# Altium schematic sheet Функциональная.SchDoc
size 389 x 214 mm
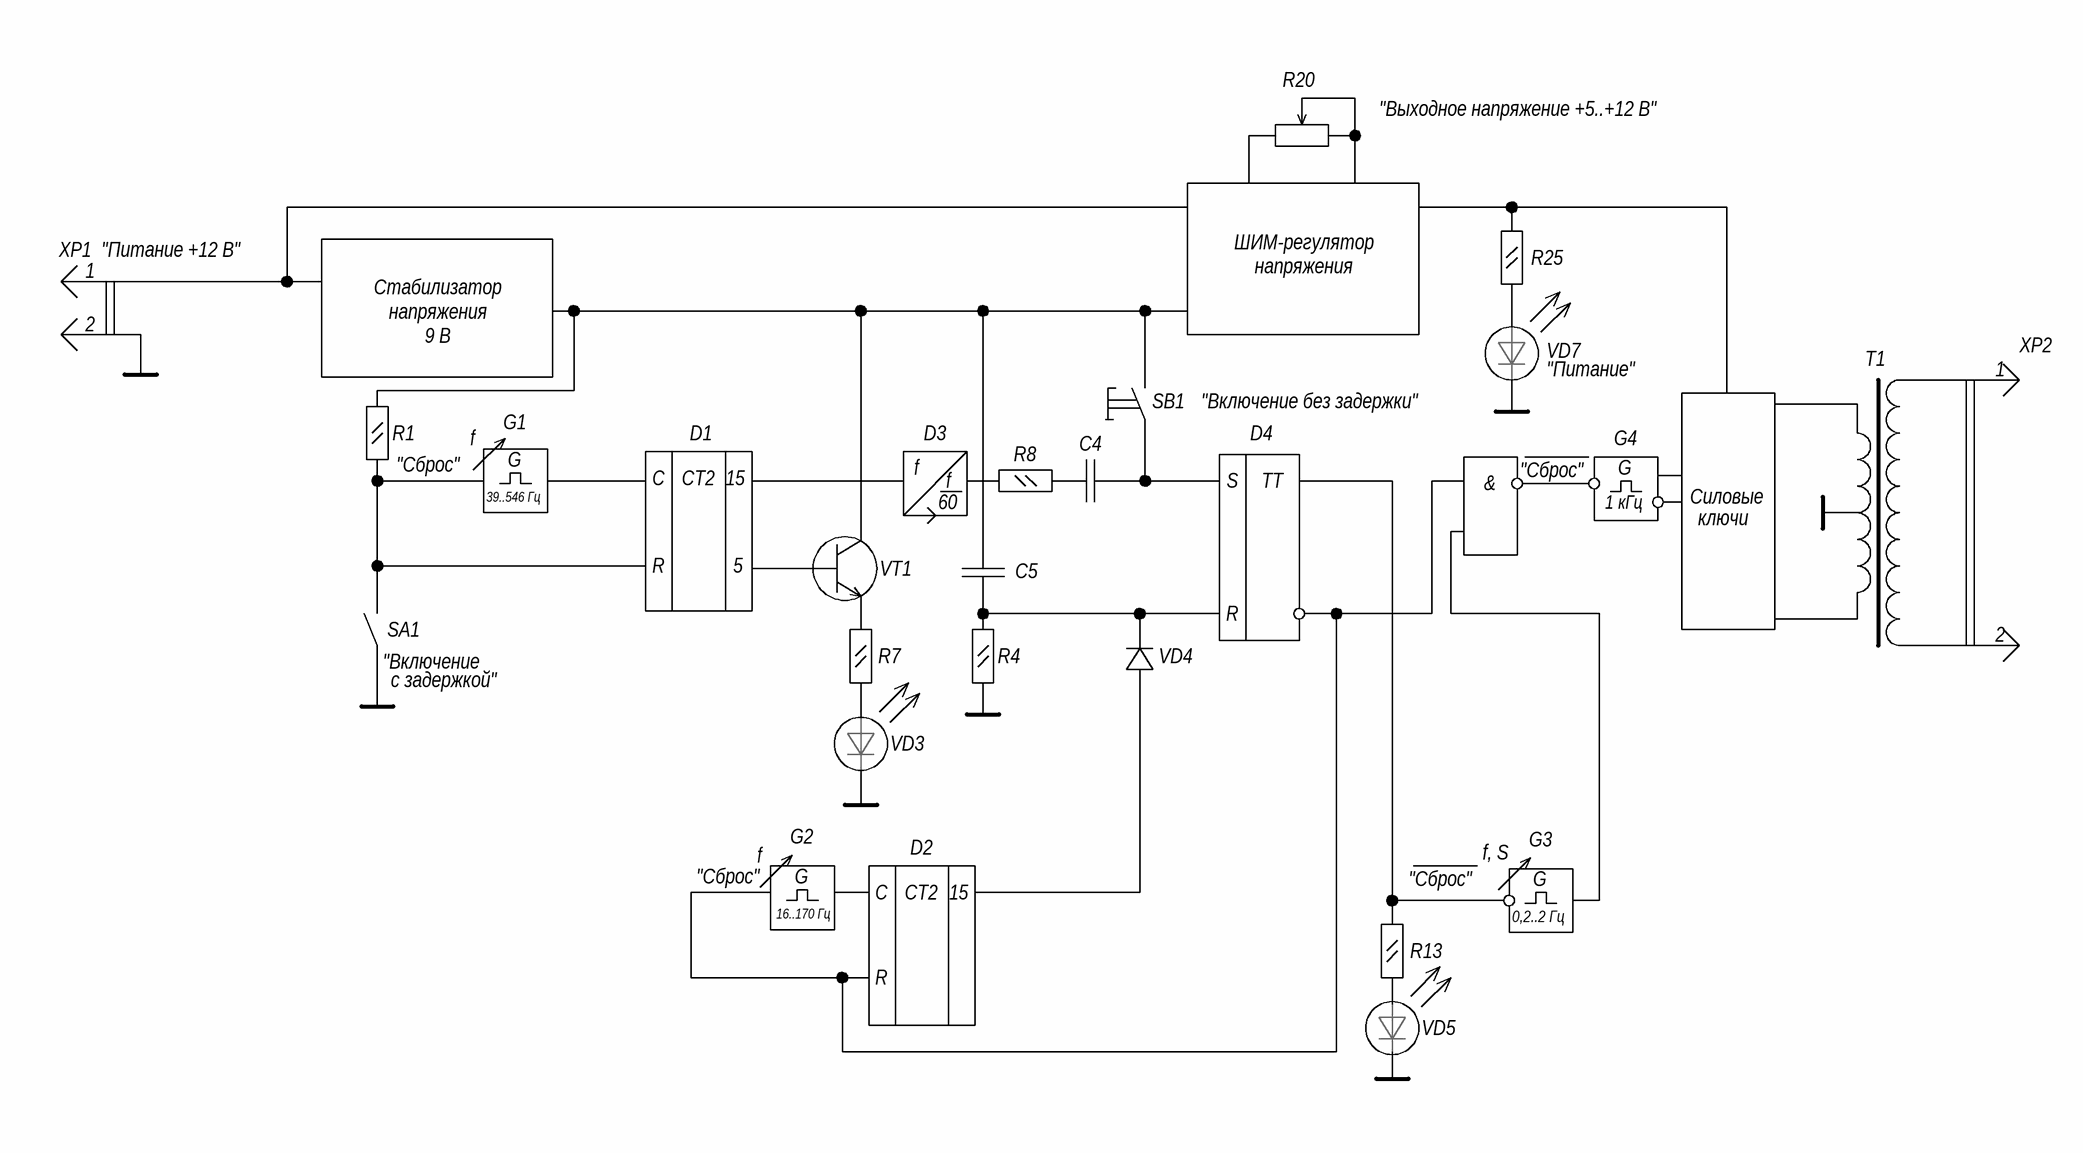
[diagram p0: Функциональная.SchDoc]

## Notes on the sheet
- R20
- "Выходное напряжение +5..+12 В"
- XP1
- 1
- "Питание +12 В"
- ШИМ-регулятор
  напряжения
- R25
- 2
- Стабилизатор
  напряжения
  9 В
- VD7
- "Питание"
- T1
- XP2
- R1
- f
- G1
- D1
- D3
- SB1
- "Включение без задержки"
- D4
- G4
- "Сброс"
- 39..546 Гц
- G
- C
- CT2
- 15
- 60
- R8
- C4
- S
- TT
- &
- 1 кГц
- Силовые
- R
- 5
- VT1
- C5
- ключи
- SA1
- "Включение
- с задержкой"
- R7
- R4
- VD4
- VD3
- G2
- G3
- D2
- f, S
- 16..170 Гц
- R13
- 0,2..2 Гц
- VD5